# Altium project slave-18-ltc6813-1.PrjPcb (part 3 of 3)

## Sheet analog_in.SchDoc
size A3; SheetNumber: 7; SheetTotal: 15; SheetDescription: Analog Inputs
Used 2 times, as channels U_secondary_analog_in, U_primary_analog_in. Parts and nets are listed once, with the designators drawn on the sheet.
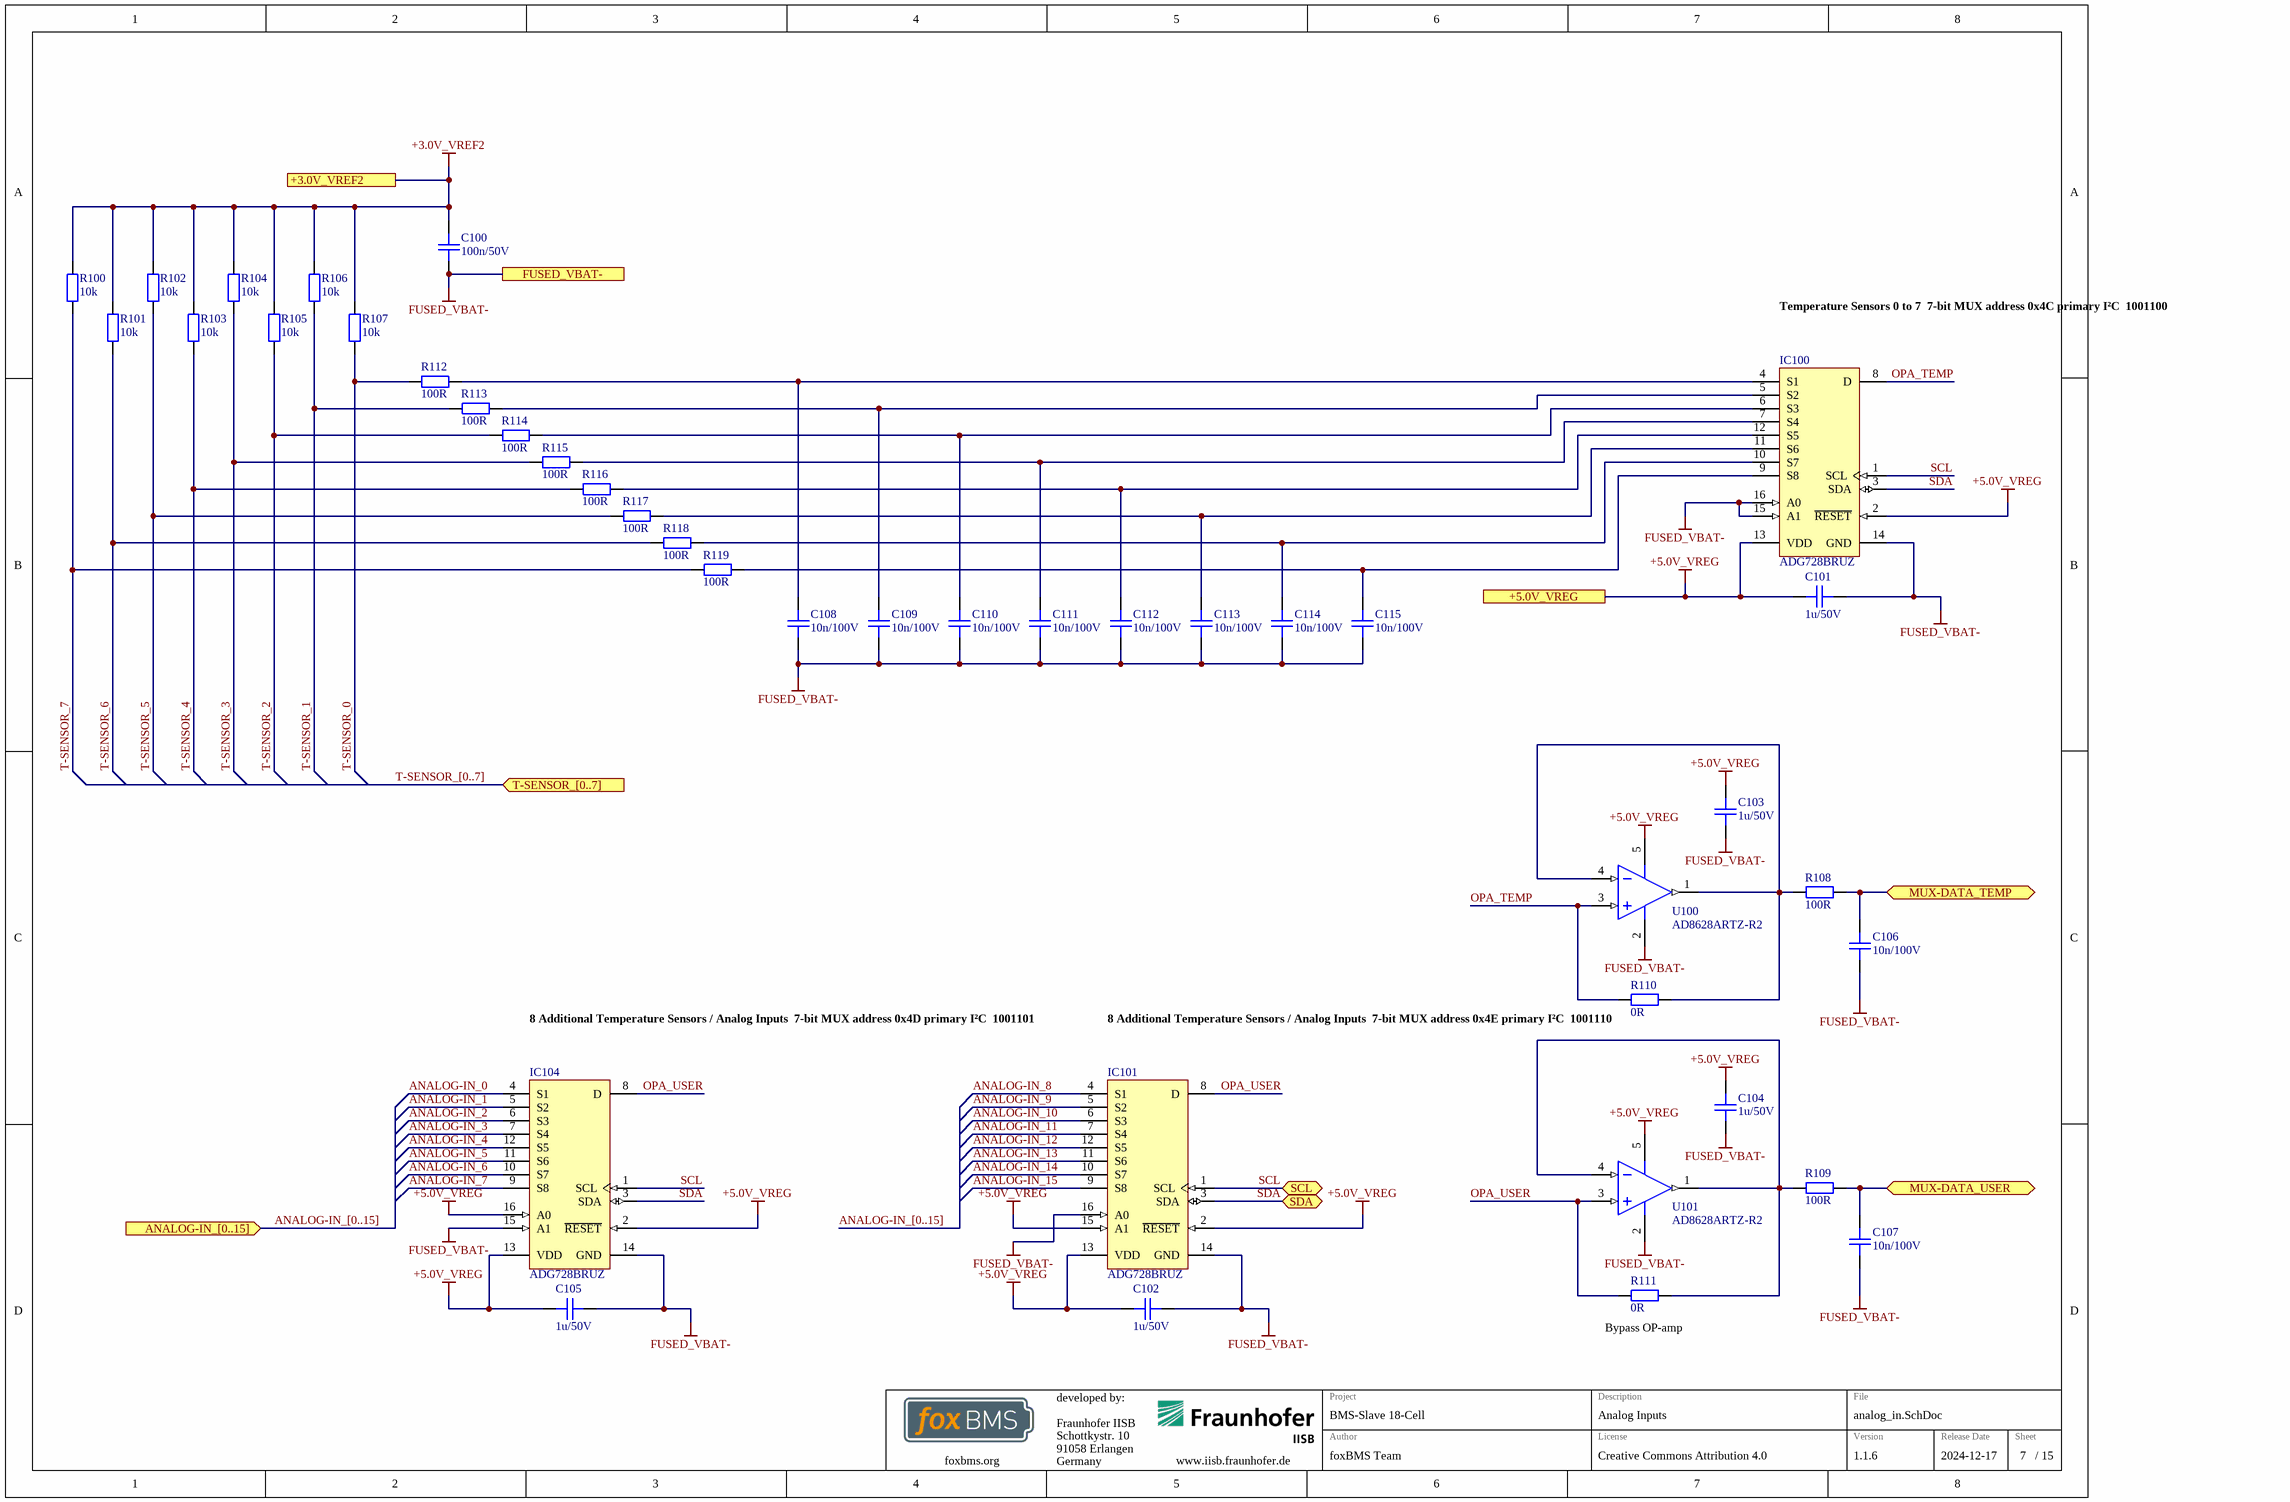
[diagram p10: analog_in.SchDoc]

### Parts
C100  100n/50V  [CAPC1608X08N]
C101  1u/50V  [CAPC2012X14N]
C102  1u/50V  [CAPC2012X14N]
C103  1u/50V  [CAPC2012X14N]
C104  1u/50V  [CAPC2012X14N]
C105  1u/50V  [CAPC2012X14N]
C106  10n/100V  [CAPC1608X08N]
C107  10n/100V  [CAPC1608X08N]
C108  10n/100V  [CAPC1608X08N]
C109  10n/100V  [CAPC1608X08N]
C110  10n/100V  [CAPC1608X08N]
C111  10n/100V  [CAPC1608X08N]
C112  10n/100V  [CAPC1608X08N]
C113  10n/100V  [CAPC1608X08N]
C114  10n/100V  [CAPC1608X08N]
C115  10n/100V  [CAPC1608X08N]
IC100  ADG728BRUZ  [ADI-RU-16_M]
IC101  ADG728BRUZ  [ADI-RU-16_M]
IC104  ADG728BRUZ  [ADI-RU-16_M]
R100  10k  [RESC1608X05N]
R101  10k  [RESC1608X05N]
R102  10k  [RESC1608X05N]
R103  10k  [RESC1608X05N]
R104  10k  [RESC1608X05N]
R105  10k  [RESC1608X05N]
R106  10k  [RESC1608X05N]
R107  10k  [RESC1608X05N]
R108  100R  [RESC1608X05N]
R109  100R  [RESC1608X05N]
R110  0R  [RESC1608X05N]
R111  0R  [RESC1608X05N]
R112  100R  [RESC1608X05N]
R113  100R  [RESC1608X05N]
R114  100R  [RESC1608X05N]
R115  100R  [RESC1608X05N]
R116  100R  [RESC1608X05N]
R117  100R  [RESC1608X05N]
R118  100R  [RESC1608X05N]
R119  100R  [RESC1608X05N]
U100  AD8628ARTZ-R2  [ADI-RJ-5_M]
U101  AD8628ARTZ-R2  [ADI-RJ-5_M]

### Ports
+3.0V_VREF2, +5.0V_VREG, ANALOG-IN_[0..15] (in), FUSED_VBAT-, MUX-DATA_TEMP (bidir), MUX-DATA_USER (bidir), SCL (bidir), SDA (bidir), T-SENSOR_[0..7] (in)

### Nets
+3.0V_VREF2: C100.2 R100.2 R101.2 R102.2 R103.2 R104.2 R105.2 R106.2 R107.2 ; port +3.0V_VREF2
+5.0V_VREG: C101.2 C102.2 C103.2 C104.2 C105.2 IC100.2(~{RESET}) IC100.13(VDD) IC101.2(~{RESET}) IC101.13(VDD) IC101.15(A1) IC104.2(~{RESET}) IC104.13(VDD) IC104.16(A0) U100.5(+V) U101.5(+V) ; port +5.0V_VREG
FUSED_VBAT-: C100.1 C101.1 C102.1 C103.1 C104.1 C105.1 C106.1 C107.1 C108.1 C109.1 C110.1 C111.1 C112.1 C113.1 C114.1 C115.1 IC100.14(GND) IC100.15(A1) IC100.16(A0) IC101.14(GND) IC101.16(A0) IC104.14(GND) IC104.15(A1) U100.2(-V) U101.2(-V) ; port FUSED_VBAT-
ANALOG-IN_0: IC104.4(S1)
ANALOG-IN_1: IC104.5(S2)
ANALOG-IN_2: IC104.6(S3)
ANALOG-IN_3: IC104.7(S4)
ANALOG-IN_4: IC104.12(S5)
ANALOG-IN_5: IC104.11(S6)
ANALOG-IN_6: IC104.10(S7)
ANALOG-IN_7: IC104.9(S8)
ANALOG-IN_8: IC101.4(S1)
ANALOG-IN_9: IC101.5(S2)
ANALOG-IN_10: IC101.6(S3)
ANALOG-IN_11: IC101.7(S4)
ANALOG-IN_12: IC101.12(S5)
ANALOG-IN_13: IC101.11(S6)
ANALOG-IN_14: IC101.10(S7)
ANALOG-IN_15: IC101.9(S8)
MUX-DATA_TEMP: C106.2 R108.2 ; port MUX-DATA_TEMP
MUX-DATA_USER: C107.2 R109.2 ; port MUX-DATA_USER
OPA_TEMP: IC100.8(D) R110.1 U100.3(+IN)
OPA_USER: IC101.8(D) IC104.8(D) R111.1 U101.3(+IN)
SCL: IC100.1(SCL) IC101.1(SCL) IC104.1(SCL) ; port SCL
SDA: IC100.3(SDA) IC101.3(SDA) IC104.3(SDA) ; port SDA
T-SENSOR_0: R107.1 R112.2
T-SENSOR_1: R106.1 R113.2
T-SENSOR_2: R105.1 R114.2
T-SENSOR_3: R104.1 R115.2
T-SENSOR_4: R103.1 R116.2
T-SENSOR_5: R102.1 R117.2
T-SENSOR_6: R101.1 R118.2
T-SENSOR_7: R100.1 R119.2
NetC108_2: C108.2 IC100.4(S1) R112.1
NetC109_2: C109.2 IC100.5(S2) R113.1
NetC110_2: C110.2 IC100.6(S3) R114.1
NetC111_2: C111.2 IC100.7(S4) R115.1
NetC112_2: C112.2 IC100.12(S5) R116.1
NetC113_2: C113.2 IC100.11(S6) R117.1
NetC114_2: C114.2 IC100.10(S7) R118.1
NetC115_2: C115.2 IC100.9(S8) R119.1
NetR108_1: R108.1 R110.2 U100.1(OUT) U100.4(-IN)
NetR109_1: R109.1 R111.2 U101.1(OUT) U101.4(-IN)

### Channels
U_secondary_analog_in: designators end in _2; ports +3.0V_VREF2=+3.0V_VREF2 +5.0V_VREG=+5.0V_VREG FUSED_VBAT-=FUSED_VBAT- MUX-DATA_TEMP=SECONDARY-MUX-DATA_TEMP MUX-DATA_USER=SECONDARY-MUX-DATA_USER SCL=SECONDARY-SCL SDA=SECONDARY-SDA
U_primary_analog_in: designators end in _1; ports +3.0V_VREF2=+3.0V_VREF2 +5.0V_VREG=+5.0V_VREG FUSED_VBAT-=FUSED_VBAT- MUX-DATA_TEMP=PRIMARY-MUX-DATA_TEMP MUX-DATA_USER=PRIMARY-MUX-DATA_USER SCL=PRIMARY-SCL SDA=PRIMARY-SDA

### Buses and harness runs
bus ANALOG-IN_[0..15]
bus ANALOG-IN_[0..15] = port ANALOG-IN_[0..15]
bus T-SENSOR_[0..7] = port T-SENSOR_[0..7]

### Notes on the sheet
- Temperature Sensors 0 to 7
  7-bit MUX address 0x4C primary I²C
  1001100
- 8 Additional Temperature Sensors / Analog Inputs
  7-bit MUX address 0x4D primary I²C
  1001101
- (near R110) 8 Additional Temperature Sensors / Analog Inputs
  7-bit MUX address 0x4E primary I²C
  1001110
- (near R111) Bypass OP-amp
- Fraunhofer IISB
- Schottkystr. 10
- developed by:
- 91058 Erlangen
- Germany
- Author
- Project
- License
- Description
- File
- Version
- Release Date
- Sheet
- foxbms.org <https://foxbms.org>
- www.iisb.fraunhofer.de <https://www.iisb.fraunhofer.de/>
- foxBMS Team
- /

### Library data of the parts
C100 = gen_C_ceramic_100n_50V_X7R_0603: MLCC; Capacitance: 100n; Rated Voltage: 50V; Dielectric: X7R; Case EIA: 0603; Case Metric: 1608; PnP Package: C_0603_10; PnP Value: 100n/50V/X7R; PnP equipped: x; Automotive Qualified: True; Part Number: gen_C_ceramic_100n_50V_X7R_0603; Supplier 1: Farnell; Supplier Part Number 1: 2525267; Supplier 2: Digikey; Supplier Part Number 2: 490-6049-1-ND; Supplier 3: Farnell; Supplier Part Number 3: 2070398
C101-C105 = gen_C_ceramic_1u_50V_X7R_0805: as C1401-C1403 on sheet LTC; Part Number: gen_C_ceramic_1u_50V_X7R_0805; Supplier 1: Farnell; Supplier Part Number 1: 2672199; Operating Temperature: -55°C - +125°C; Supplier 2: Farnell; Supplier Part Number 2: 2479894; Supplier 3: Farnell; Supplier Part Number 3: 2464630
C106-C115 = gen_C_ceramic_10n_100V_X7R_0603: MLCC; Capacitance: 10n; Rated Voltage: 100V; Dielectric: X7R; Case EIA: 0603; Case Metric: 1608; Automotive Qualified: True; Part Number: gen_C_ceramic_10n_100V_X7R_0603; Supplier 1: Farnell; Supplier Part Number 1: 1301715; Supplier 2: Farnell; Supplier Part Number 2: 2821192; Supplier 3: Farnell; Supplier Part Number 3: 2210878
IC100 IC101 IC104 = CMP-0798-00197-1: CMOS, Low Voltage, 2-Wire Serially Controlled, Matrix Switch, -40 to 85 degC, 16-pin SOP (RU-16), Tube; Manufacturer: Analog Devices; Ron (ohms): 2.5; Supply V Guar Performance: Single_(+3V), Single_(+5V); Max Analog Signal Range: 0 to Vdd; Bandwidth (Hz): 65M; ComponentLink3Description: Package Specification; Packing: Tube; PartNumber: ADG728BRUZ; ComponentLink1URL: http://www.analog.com/en/index.html; Mounting Technology: Surface Mount; DatasheetVersion: Rev. C; ComponentLink1Description: Manufacturer URL; ComponentLink3URL: http:/www.analog.com/static/imported-files/packages/36244347913743854010197452789RU16.pdf; ComponentLink2URL: http://www.analog.com/static/imported-files/data_sheets/ADG728_729.pdf; PackageVersion: Nov-02; PackageDescription: 16-Pin Thin Shrink Small Outline Package, Body 5 x 4.4 mm, Pitch 0.65 mm; Code_JEDEC: MO-153AB; PackageReference: RU-16; ComponentLink2Description: Datasheet
R100-R107 = gen_R_10k_0603: as R1421-R1427 on sheet LTC; Part Number: gen_R_10k_0603; Operating Temperature: -55°C - +155°C; Resistance: 10k; Series: E24, E96; PnP Value: 10k; Supplier 1: Farnell; Supplier Part Number 1: 2073349
R108 R109 R112-R119 = gen_R_100R_0603: SMD Resistor 100R 0603; Tolerance: 1%; Power: 0.1W; Case EIA: 0603; Case Metric: 1608; Maximum Working Voltage: 75V; PnP Package: R_0603; Automotive Qualified: True; Part Number: gen_R_100R_0603; Operating Temperature: -55°C - +155°C; Resistance: 100R; Series: E24, E96; PnP Value: 100R; Supplier 1: Digikey; Supplier Part Number 1: P100HCT-ND
R110 R111 = gen_R_0R_0603: as R1406-R1417 on sheet LTC; Part Number: gen_R_0R_0603; Operating Temperature: -55°C - +155°C; Resistance: 0R; Series: Jumper; PnP Value: 0R; Supplier 1: Farnell; Supplier Part Number 1: 2616580
U100 U101 = CMP-0384-01512-2: Single Channel RRIO Operational Amplifier, 2.5 MHz BW, 1 V/us SR, Industrial, 5-pin SOT23 (RJ-5), Reel; Manufacturer: Analog Devices; Generic Part Number: AD8628; Iq/Amp: 1.1mA; Automotive Qualified: Yes; V Span Max: 6V; Input Bias Current: 30pA; Slew Rate: 1V/us; Amplifiers Per Package: 1; Input Offset Voltage: 1uV; Small Signal Bandwidth: 2.5MHz; V Span Min: 2.7V; ComponentLink1Description: Manufacturer URL; DatasheetVersion: Rev. I; ComponentLink4Description: Reference Circuit; Code_JEDEC: MO-178-AA; PackageDescription: 5-Pin Small Outline Transistor Package, Body 2.9 x 1.6 mm, Pitch 0.95 mm; ComponentLink3URL: http://www.analog.com/static/imported-files/packages/PKG_PDF/SOT-23(RJ)/RJ_5.pdf; PackageReference: RJ-5; ComponentLink1URL: http://www.analog.com/en/index.html; PackageVersion: 121608-A; RevisionNote: Reference Circuit URL fixed; Mounting Technology: Surface Mount; ComponentLink2Description: Datasheet; ComponentLink3Description: Package Specification; ComponentLink4URL: http://www.analog.com/en/all-operational-amplifiers-op-amps/operational-amplifiers-op-amps/ad8628/products/product.html#product-recommendations; ComponentLink2URL: http://www.analog.com/static/imported-files/data_sheets/AD8628_8629_8630.pdf; PartNumber: AD8628ARTZ-R2

## Sheet daisy_chain_connectors.SchDoc
size A3; SheetNumber: 12; SheetTotal: 15; SheetDescription: Daisy-Chain Connectors
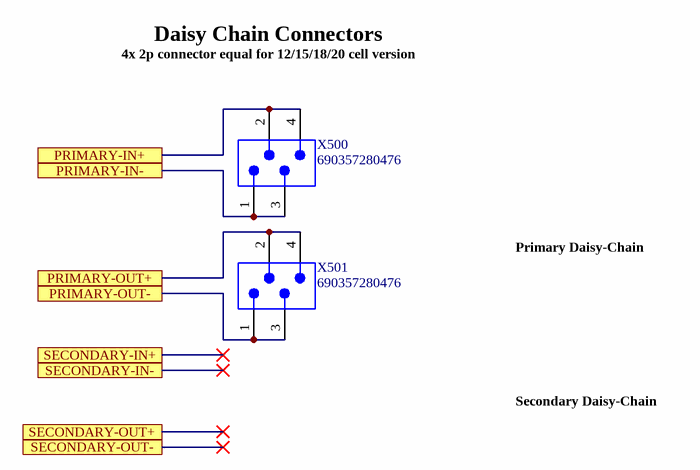
[diagram p11: daisy_chain_connectors.SchDoc]

### Parts
X500  690357280476  [690357280476]
X501  690357280476  [690357280476]

### Ports
PRIMARY-IN+, PRIMARY-IN-, PRIMARY-OUT+, PRIMARY-OUT-, SECONDARY-IN+, SECONDARY-IN-, SECONDARY-OUT+, SECONDARY-OUT-

### Nets
PRIMARY-IN+: X500.2 X500.4 ; port PRIMARY-IN+
PRIMARY-IN-: X500.1 X500.3 ; port PRIMARY-IN-
PRIMARY-OUT+: X501.2 X501.4 ; port PRIMARY-OUT+
PRIMARY-OUT-: X501.1 X501.3 ; port PRIMARY-OUT-

### Notes on the sheet
- Daisy Chain Connectors
- 4x 2p connector equal for 12/15/18/20 cell version
- Primary Daisy-Chain
- Secondary Daisy-Chain
- Fraunhofer IISB
- Schottkystr. 10
- developed by:
- 91058 Erlangen
- Germany
- Author
- Project
- License
- Description
- File
- Version
- Release Date
- Sheet
- foxbms.org <https://foxbms.org>
- www.iisb.fraunhofer.de <https://www.iisb.fraunhofer.de/>
- foxBMS Team
- /

### Library data of the parts
X500 X501 = CMP-1502-00889-2: NexarPartId: 8917647; Connector Type: Male Pin; Contact Resistance: 10mΩ; Pitch: 2.54mm; Insulation Resistance: 1GΩ; Number of Contacts: 4; Current Rating: 1.5A; Operating Supply Voltage: 100V; Gender: Male; Row Spacing: 1.4986mm; Orientation: Straight; Length: 5.91mm; RoHS: Compliant; Contact Plating: Tin; Contact Material: Bronze; Number of Positions: 4; Color: Red; Lead Pitch: 2.54mm; Number of Pins: 4; Packaging: Tape and Reel; Termination: Solder; Number of Rows: 2; REACH SVHC: Unknown; Max Operating Temperature: 105°C; Voltage Rating: 100V; Mount: Surface Mount; Fastening Type: Ramp; Min Operating Temperature: -40°C

## Sheet ext_supply_con.SchDoc
size A3; SheetNumber: 13; SheetTotal: 15; SheetDescription: External Supply Connectors
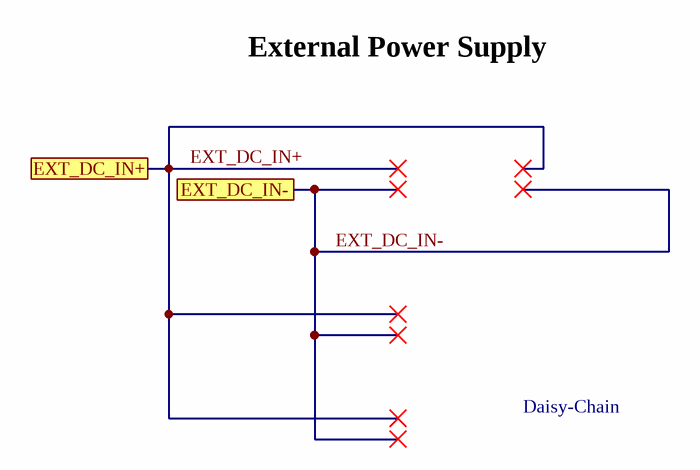
[diagram p12: ext_supply_con.SchDoc]

### Ports
EXT_DC_IN+, EXT_DC_IN-

### Notes on the sheet
- External Power Supply
- Daisy-Chain
- Fraunhofer IISB
- Schottkystr. 10
- developed by:
- 91058 Erlangen
- Germany
- Author
- Project
- License
- Description
- File
- Version
- Release Date
- Sheet
- foxbms.org <https://foxbms.org>
- www.iisb.fraunhofer.de <https://www.iisb.fraunhofer.de/>
- foxBMS Team
- /

## Sheet bat_connectors.SchDoc
size A3; SheetNumber: 14; SheetTotal: 15; SheetDescription: Sense Connectors
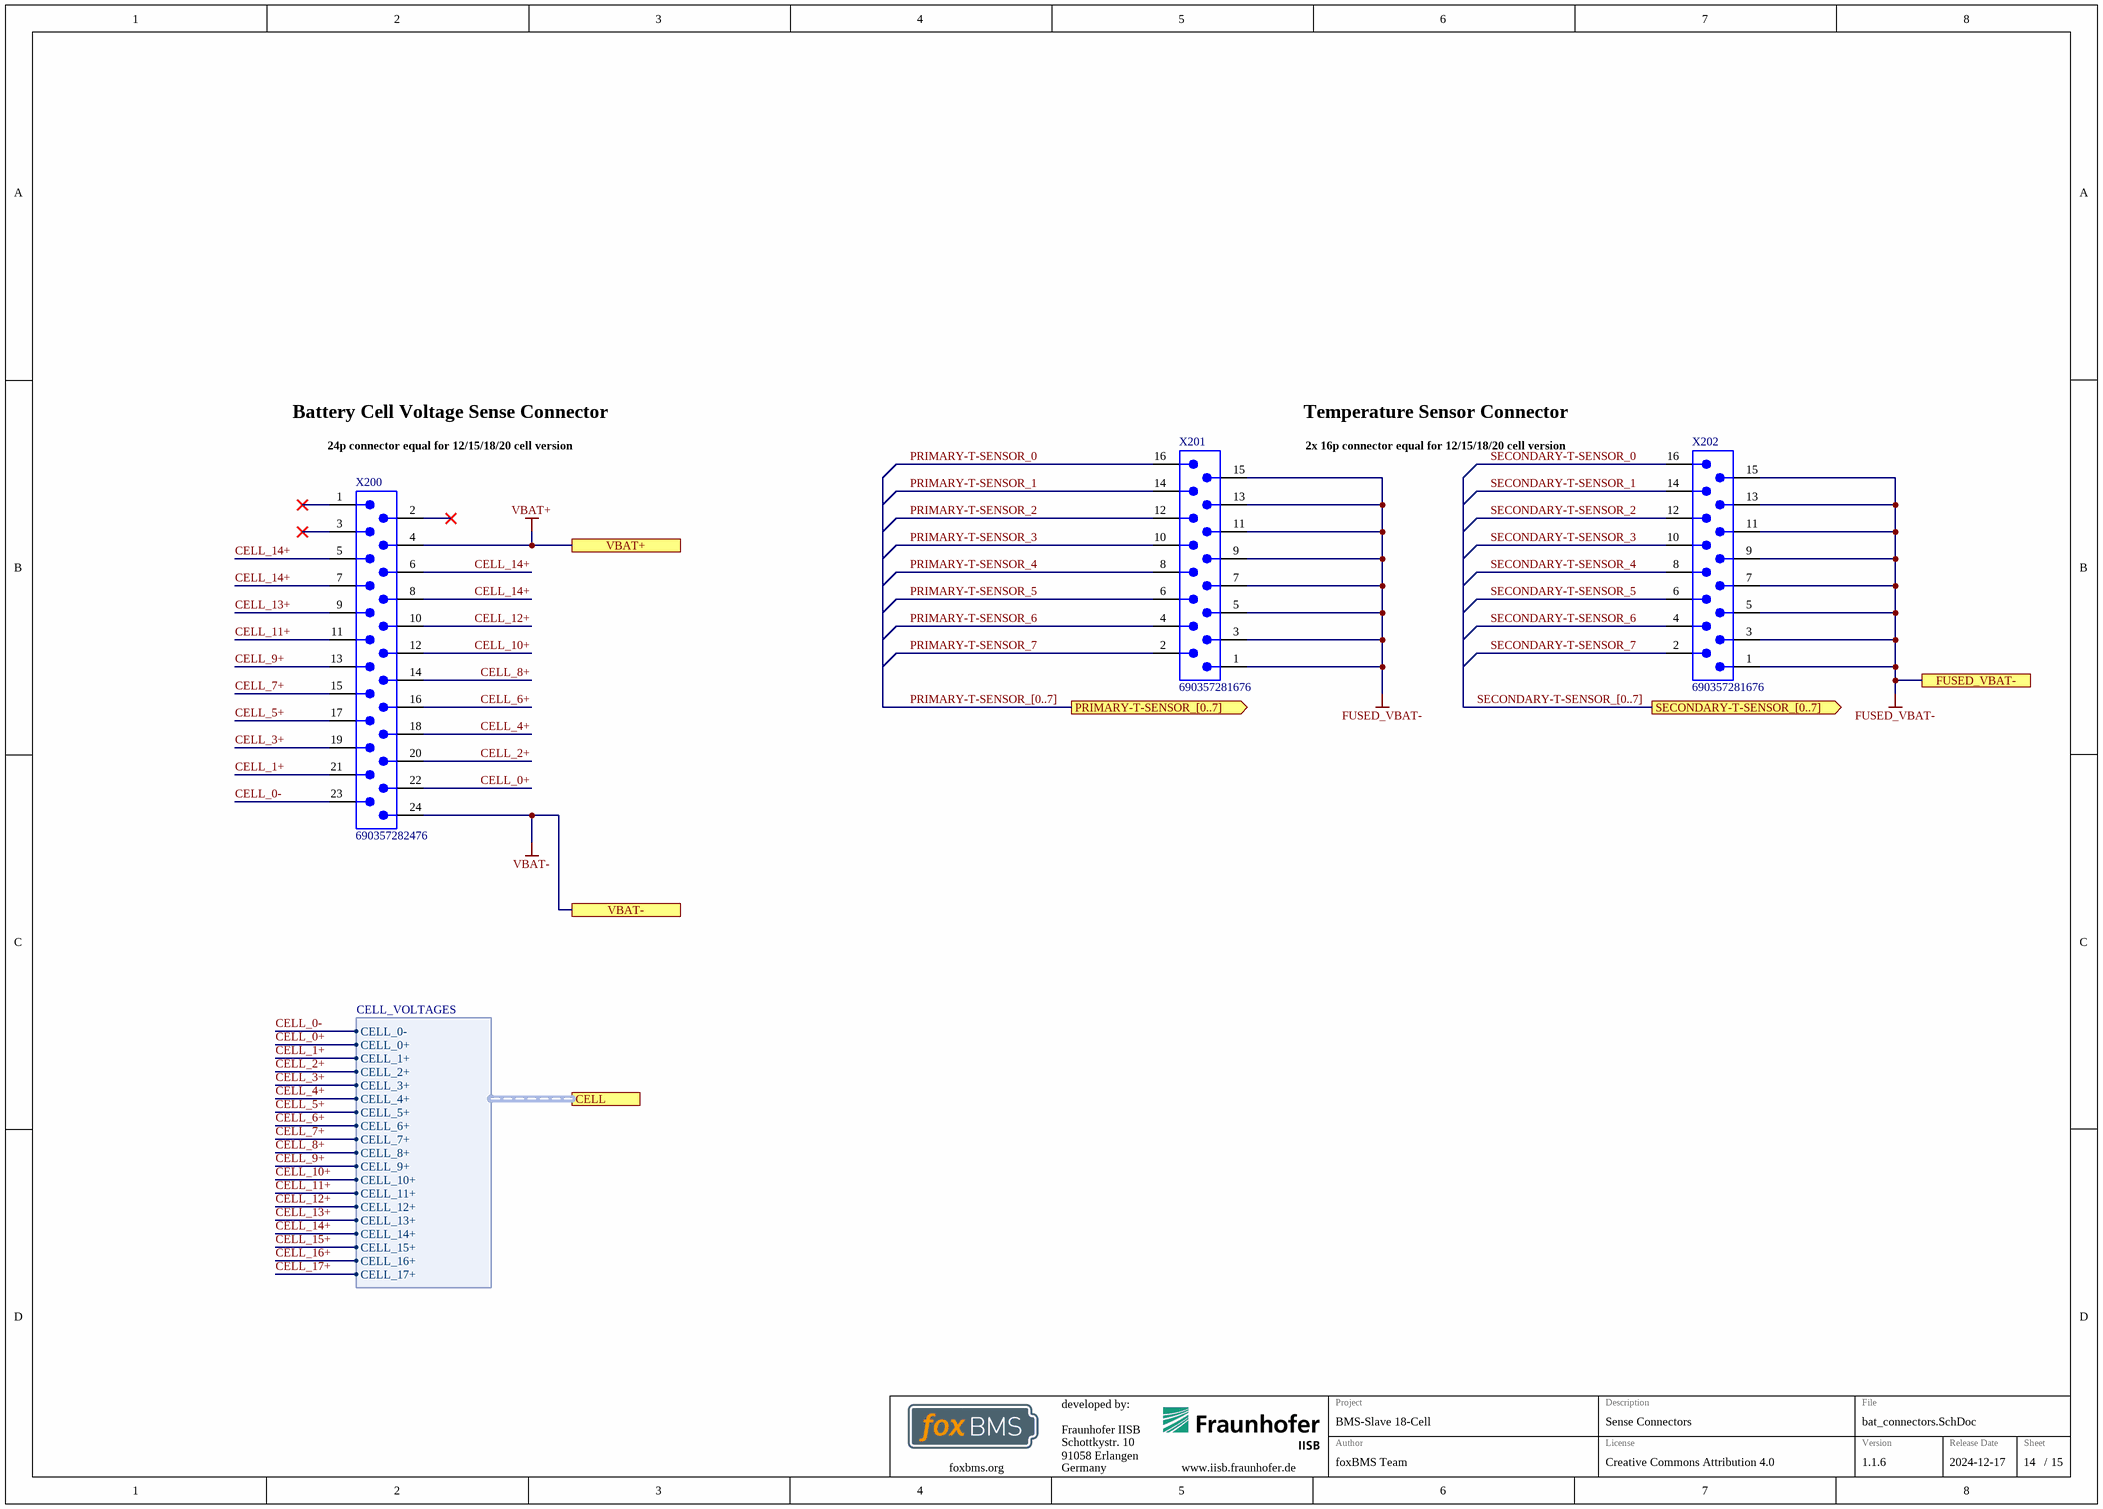
[diagram p13: bat_connectors.SchDoc]

### Parts
X200  690357282476  [690357282476]
X201  690357281676  [690357281676]
X202  690357281676  [690357281676]

### Ports
CELL (harness CELL_VOLTAGES), FUSED_VBAT-, PRIMARY-T-SENSOR_[0..7] (out), SECONDARY-T-SENSOR_[0..7] (out), VBAT+, VBAT-

### Harnesses
CELL_VOLTAGES: CELL_0-, CELL_0+, CELL_1+, CELL_2+, CELL_3+, CELL_4+, CELL_5+, CELL_6+, CELL_7+, CELL_8+, CELL_9+, CELL_10+, CELL_11+, CELL_12+, CELL_13+, CELL_14+, CELL_15+, CELL_16+, CELL_17+

### Nets
FUSED_VBAT-: X201.1 X201.3 X201.5 X201.7 X201.9 X201.11 X201.13 X201.15 X202.1 X202.3 X202.5 X202.7 X202.9 X202.11 X202.13 X202.15 ; port FUSED_VBAT-
VBAT+: X200.4 ; port VBAT+
VBAT-: X200.24 ; port VBAT-
CELL_0+: X200.22 ; port CELL.CELL_0+
CELL_0-: X200.23 ; port CELL.CELL_0-
CELL_1+: X200.21 ; port CELL.CELL_1+
CELL_2+: X200.20 ; port CELL.CELL_2+
CELL_3+: X200.19 ; port CELL.CELL_3+
CELL_4+: X200.18 ; port CELL.CELL_4+
CELL_5+: X200.17 ; port CELL.CELL_5+
CELL_6+: X200.16 ; port CELL.CELL_6+
CELL_7+: X200.15 ; port CELL.CELL_7+
CELL_8+: X200.14 ; port CELL.CELL_8+
CELL_9+: X200.13 ; port CELL.CELL_9+
CELL_10+: X200.12 ; port CELL.CELL_10+
CELL_11+: X200.11 ; port CELL.CELL_11+
CELL_12+: X200.10 ; port CELL.CELL_12+
CELL_13+: X200.9 ; port CELL.CELL_13+
CELL_14+: X200.5 X200.6 X200.7 X200.8 ; port CELL.CELL_14+
CELL_15+: port CELL.CELL_15+
CELL_16+: port CELL.CELL_16+
CELL_17+: port CELL.CELL_17+
PRIMARY-T-SENSOR_0: X201.16
PRIMARY-T-SENSOR_1: X201.14
PRIMARY-T-SENSOR_2: X201.12
PRIMARY-T-SENSOR_3: X201.10
PRIMARY-T-SENSOR_4: X201.8
PRIMARY-T-SENSOR_5: X201.6
PRIMARY-T-SENSOR_6: X201.4
PRIMARY-T-SENSOR_7: X201.2
SECONDARY-T-SENSOR_0: X202.16
SECONDARY-T-SENSOR_1: X202.14
SECONDARY-T-SENSOR_2: X202.12
SECONDARY-T-SENSOR_3: X202.10
SECONDARY-T-SENSOR_4: X202.8
SECONDARY-T-SENSOR_5: X202.6
SECONDARY-T-SENSOR_6: X202.4
SECONDARY-T-SENSOR_7: X202.2

Not connected (* = marked no-connect by the designer): X200 1* 2* 3*

### Buses and harness runs
bus PRIMARY-T-SENSOR_[0..7] = port PRIMARY-T-SENSOR_[0..7]
bus SECONDARY-T-SENSOR_[0..7] = port SECONDARY-T-SENSOR_[0..7]

### Notes on the sheet
- Battery Cell Voltage Sense Connector
- 24p connector equal for 12/15/18/20 cell version
- Temperature Sensor Connector
- 2x 16p connector equal for 12/15/18/20 cell version
- Fraunhofer IISB
- Schottkystr. 10
- developed by:
- 91058 Erlangen
- Germany
- Author
- Project
- License
- Description
- File
- Version
- Release Date
- Sheet
- foxbms.org <https://foxbms.org>
- www.iisb.fraunhofer.de <https://www.iisb.fraunhofer.de/>
- foxBMS Team
- /

### Library data of the parts
X200 = CMP-1502-00899-2: NexarPartId: 65759601; Gender: Male; Operating Supply Voltage: 100V; Current Rating: 1.5A; Insulation Resistance: 1GΩ; Contact Resistance: 10mΩ; Pitch: 2.54mm; Max Operating Temperature: 105°C; RoHS: Compliant; Lead Pitch: 2.54mm; Packaging: Tape and Reel; Number of Pins: 24; Length: 31.31mm; Min Operating Temperature: -40°C
X201 X202 = CMP-1502-00895-2: NexarPartId: 65759598; Operating Supply Voltage: 100V; Gender: Male; Pitch: 2.54mm; Insulation Resistance: 1GΩ; Contact Resistance: 10mΩ; Current Rating: 1.5A; RoHS: Compliant; Min Operating Temperature: -40°C; Packaging: Tape and Reel; Lead Pitch: 2.54mm; Number of Pins: 16; Max Operating Temperature: 105°C; Length: 21.15mm

## Sheet dcdc_converter.SchDoc
size A3; SheetNumber: 15; SheetTotal: 15; SheetDescription: DC/DC
Used 2 times, as channels U_primary_dcdc_converter, U_secondary_dcdc_converter. Parts and nets are listed once, with the designators drawn on the sheet.
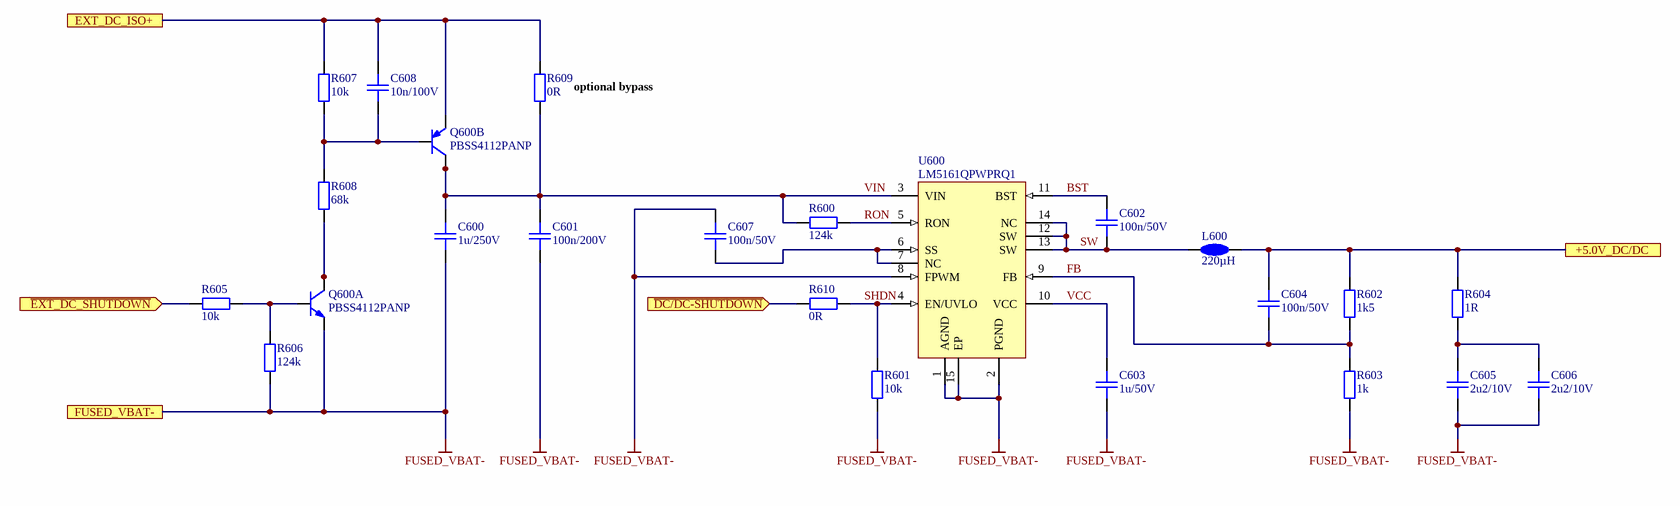
[diagram p14: dcdc_converter.SchDoc]

### Parts
C600  1u/250V  [CAPC4532X16N]
C601  100n/200V  [CAPC3216X18N]
C602  100n/50V  [CAPC1608X08N]
C603  1u/50V  [CAPC2012X14N]
C604  100n/50V  [CAPC1608X08N]
C605  2u2/10V  [CAPC2012X14N]
C606  2u2/10V  [CAPC2012X14N]
C607  100n/50V  [CAPC1608X08N]
C608  10n/100V  [CAPC1608X08N]
L600  220µH  [TYS6045221M-10]
Q600  PBSS4112PANP  [PBSS4112PANP]  (parts A,B of 2)
R600  124k  [RESC1608X05N]
R601  10k  [RESC1608X05N]
R602  1k5  [RESC1608X05N]
R603  1k  [RESC1608X05N]
R604  1R  [RESC2012X05N]
R605  10k  [RESC1608X05N]
R606  124k  [RESC1608X05N]
R607  10k  [RESC1608X05N]
R608  68k  [RESC1608X05N]
R609  0R  [RESC1608X05N]
R610  0R  [RESC1608X05N]
U600  LM5161QPWPRQ1  [PWP0014A]

### Ports
+5.0V_DC/DC, EXT_DC_ISO+, FUSED_VBAT-, ~{DC/DC-SHUTDOWN} (in), ~{EXT_DC_SHUTDOWN} (in)

### Nets
FUSED_VBAT-: C600.1 C601.1 C603.1 C605.1 C606.1 C607.2 Q600.1(E) R601.2 R603.2 R606.1 U600.1(AGND) U600.2(PGND) U600.8(FPWM) U600.15(EP) ; port FUSED_VBAT-
+5.0V_DC/DC: C604.2 L600.2 R602.1 R604.1 ; port +5.0V_DC/DC
~{DC/DC-SHUTDOWN}: R610.2 ; port ~{DC/DC-SHUTDOWN}
~{EXT_DC_SHUTDOWN}: R605.1 ; port ~{EXT_DC_SHUTDOWN}
BST: C602.2 U600.11(BST)
EXT_DC_ISO+: C608.1 Q600.4(E) R607.2 R609.2 ; port EXT_DC_ISO+
FB: C604.1 R602.2 R603.1 U600.9(FB)
RON: R600.1 U600.5(RON)
SHDN: R601.1 R610.1 U600.4(EN/UVLO)
SW: C602.1 L600.1 U600.12(SW) U600.13(SW) U600.14(NC)
VCC: C603.2 U600.10(VCC)
VIN: C600.2 C601.2 Q600.3(C) Q600.8(C) R600.2 R609.1 U600.3(VIN)
NetC605_2: C605.2 C606.2 R604.2
NetC607_1: C607.1 U600.6(SS) U600.7(NC)
NetC608_2: C608.2 Q600.5(B) R607.1 R608.2
NetQ600_2: Q600.2(B) R605.2 R606.2
NetQ600_6: Q600.6(C) Q600.7(C) R608.1

### Channels
U_primary_dcdc_converter: designators end in _1; ports +5.0V_DC/DC=+5.0V_VREG EXT_DC_ISO+=EXT_DC_ISO+ FUSED_VBAT-=FUSED_VBAT- ~{DC/DC-SHUTDOWN}=PRIMARY-LTC-DRIVE ~{EXT_DC_SHUTDOWN}=PRIMARY-LTC-DRIVE
U_secondary_dcdc_converter: designators end in _2; ports +5.0V_DC/DC=+5.0V_VREG EXT_DC_ISO+=EXT_DC_ISO+ FUSED_VBAT-=FUSED_VBAT- ~{DC/DC-SHUTDOWN}=SECONDARY-LTC-DRIVE ~{EXT_DC_SHUTDOWN}=SECONDARY-LTC-DRIVE

### Notes on the sheet
- (near R609) optional bypass
- Fraunhofer IISB
- Schottkystr. 10
- developed by:
- 91058 Erlangen
- Germany
- Author
- Project
- License
- Description
- File
- Version
- Release Date
- Sheet
- foxbms.org <https://foxbms.org>
- www.iisb.fraunhofer.de <https://www.iisb.fraunhofer.de/>
- foxBMS Team
- /

### Library data of the parts
C600 = gen_C_ceramic_1u_250V_X7R_1812: MLCC; Capacitance: 1u; Rated Voltage: 250V; Dielectric: X7T; Case EIA: 1812; Case Metric: 4532; Automotive Qualified: True; Part Number: gen_C_ceramic_1u_250V_X7R_1812; Supplier 1: Farnell; Supplier Part Number 1: 2435499
C601 = gen_C_ceramic_100n_200V_X7R_1206: MLCC; Capacitance: 100n; Rated Voltage: 200V; Dielectric: X7R; Case EIA: 1206; Case Metric: 3216; Automotive Qualified: True; Part Number: gen_C_ceramic_100n_200V_X7R_1206; Supplier 1: Farnell; Supplier Part Number 1: 2673161; Supplier 2: Farnell; Supplier Part Number 2: 2520773
C602 C604 C607 = gen_C_ceramic_100n_50V_X7R_0603: as C100 on sheet analog_in; Part Number: gen_C_ceramic_100n_50V_X7R_0603; Supplier 1: Farnell; Supplier Part Number 1: 2525267; Supplier 2: Digikey; Supplier Part Number 2: 490-6049-1-ND; Supplier 3: Farnell; Supplier Part Number 3: 2070398
C603 = gen_C_ceramic_1u_50V_X7R_0805: as C1401-C1403 on sheet LTC; Part Number: gen_C_ceramic_1u_50V_X7R_0805; Supplier 1: Farnell; Supplier Part Number 1: 2672199; Operating Temperature: -55°C - +125°C; Supplier 2: Farnell; Supplier Part Number 2: 2479894; Supplier 3: Farnell; Supplier Part Number 3: 2464630
C605 C606 = gen_C_ceramic_2u2_10V_X7R_0805: MLCC; Capacitance: 2u2; Rated Voltage: 10V; Dielectric: X7R; Case EIA: 0805; Case Metric: 2012; Automotive Qualified: True; Part Number: gen_C_ceramic_2u2_10V_X7R_0805; Supplier 1: Farnell; Supplier Part Number 1: 2478259; Supplier 2: Farnell; Supplier Part Number 2: 2070513
C608 = gen_C_ceramic_10n_100V_X7R_0603: as C106-C115 on sheet analog_in; Part Number: gen_C_ceramic_10n_100V_X7R_0603; Supplier 1: Farnell; Supplier Part Number 1: 1301715; Supplier 2: Farnell; Supplier Part Number 2: 2821192; Supplier 3: Farnell; Supplier Part Number 3: 2210878
L600 = TYS6045221M-10: Power Inductor; Manufacturer: Laird-Signal Integrity Products; Rated Current: 590mA; Saturation Current: 700mA; Automotive Qualified: True; Part Number: TYS6045221M-10; Operating Temperature: -55°C - +150°C; ComponentLink1Description: Datasheet; ComponentLink1URL: http://assets.lairdtech.com/home/brandworld/files/TYS6045221M-10.pdf; Inductance: 220µH; Supplier 1: Digikey; Supplier Part Number 1: 240-2742-1-ND
Q600 = PBSS4112PANP: Dual NPN/PNP Transistor; Part Name: DUAL PNP/NPN; Manufacturer: Nexperia; Maximum Drain-Source Voltage: 120V; Maximum Continous Drain Current (25°C): 1A; Automotive Qualified: True; Part Number: PBSS4112PANP; Operating Temperature: -55°C - +150°C; ComponentLink1Description: Datasheet; ComponentLink1URL: https://assets.nexperia.com/documents/data-sheet/PBSS4112PANP.pdf; Supplier 2: Digikey; Supplier Part Number 2: 1727-1068-1-ND; Supplier 3: Mouser; Supplier Part Number 3: 771-PBSS4112PANP
R600 R606 = gen_R_124k_0603: SMD Resistor 124k 0603; Tolerance: 1%; Power: 0.1W; Case EIA: 0603; Case Metric: 1608; Maximum Working Voltage: 75V; PnP Package: R_0603; Automotive Qualified: True; Part Number: gen_R_124k_0603; Operating Temperature: -55°C - +155°C; Resistance: 124k; Series: E96; PnP Value: 124k; Supplier 1: Farnell; Supplier Part Number 1: 2138508
R601 R605 R607 = gen_R_10k_0603: as R1421-R1427 on sheet LTC; Part Number: gen_R_10k_0603; Operating Temperature: -55°C - +155°C; Resistance: 10k; Series: E24, E96; PnP Value: 10k; Supplier 1: Farnell; Supplier Part Number 1: 2073349
R602 = gen_R_1k5_0603: SMD Resistor 1k5 0603; Tolerance: 1%; Power: 0.1W; Case EIA: 0603; Case Metric: 1608; Maximum Working Voltage: 75V; PnP Package: R_0603; Automotive Qualified: True; Part Number: gen_R_1k5_0603; Operating Temperature: -55°C - +155°C; Resistance: 1k5; Series: E24, E96; PnP Value: 1k5; Supplier 1: Farnell; Supplier Part Number 1: 2616745
R603 = gen_R_1k_0603: SMD Resistor 1k 0603; Tolerance: 1%; Power: 0.1W; Case EIA: 0603; Case Metric: 1608; Maximum Working Voltage: 75V; PnP Package: R_0603; Automotive Qualified: True; PnP equipped: x; Part Number: gen_R_1k_0603; Operating Temperature: -55°C - +155°C; Resistance: 1k; Series: E24, E96; PnP Value: 1k; Supplier 1: Farnell; Supplier Part Number 1: 1652848
R604 = gen_R_1R_0805: SMD Resistor 1R 0805; Tolerance: 1%; Power: 0.125W; Case EIA: 0805; Case Metric: 2012; Maximum Working Voltage: 150V; PnP Package: R_0805; Automotive Qualified: True; Part Number: gen_R_1R_0805; Operating Temperature: -55°C - +155°C; Resistance: 1R; Series: E24, E96; PnP Value: 1R; Supplier 1: Farnell; Supplier Part Number 1: 2616757
R608 = gen_R_68k_0603: SMD Resistor 68k 0603; Tolerance: 1%; Power: 0.1W; Case EIA: 0603; Case Metric: 1608; Maximum Working Voltage: 75V; PnP Package: R_0603; Automotive Qualified: False; Part Number: gen_R_68k_0603; Operating Temperature: -55°C - +155°C; Resistance: 68k; Series: E24; PnP Value: 68k
R609 R610 = gen_R_0R_0603: as R1406-R1417 on sheet LTC; Part Number: gen_R_0R_0603; Operating Temperature: -55°C - +155°C; Resistance: 0R; Series: Jumper; PnP Value: 0R; Supplier 1: Farnell; Supplier Part Number 1: 2616580
U600 = LM5161QPWPRQ1: Automotive DC/DC buck converter; Manufacturer: Texas Instruments; PnP Package: HTSSOP-14; Automotive Qualified: True; Part Number: LM5161QPWPRQ1; Part Name: LM5161QPWPRQ1; Operating Temperature: −40°C - +125°C; Supplier 1: Digikey; Supplier Part Number 1: 296-47791-1-ND; Supplier 2: Mouser; Supplier Part Number 2: 595-LM5161QPWPRQ1

## Nets that join several sheets
+3.0V_VREF2: connectors (C401.2 C405.2 X400.17), U_primary_LTC (C1402_1.2 IC1400_1.50 TP1402_1.1), U_primary_analog_in (9 pins)
+3.0V_VREF2: connectors (C400.2 C406.2 X401.17), U_secondary_analog_in (9 pins), U_secondary_LTC (C1402_2.2 IC1400_2.50 TP1402_2.1)
+5.0V_VREG: connectors (C402.2 C404.2), feedback (D1100.2), U_primary_LTC (16 pins), U_primary_dcdc_converter (C604_1.2 L600_1.2 R602_1.1 R604_1.1), U_primary_digital_io (13 pins), U_primary_eeprom_temp_sens (6 pins), U_primary_analog_in (15 pins)
+5.0V_VREG: connectors (C403.2 C407.2), feedback (D1100.1), U_secondary_digital_io (13 pins), U_secondary_eeprom_temp_sens (6 pins), U_secondary_analog_in (15 pins), U_secondary_dcdc_converter (C604_2.2 L600_2.2 R602_2.1 R604_2.1), U_secondary_LTC (16 pins)
FUSED_VBAT+: cell_fuses (F300.2), U_primary_LTC (D1400_1.1), U_secondary_LTC (D1400_2.1)
FUSED_VBAT-: cell_fuses (F320.2), U_primary_input_filter (18 pins), U_secondary_input_filter (18 pins), ext_supply (5 pins), connectors (10 pins), feedback (C1100.1 R1118.2), U_primary_LTC (14 pins), U_secondary_digital_io (C700_2.1 C701_2.1 U700_2.2 U700_2.8), U_secondary_eeprom_temp_sens (5 pins), U_secondary_analog_in (25 pins), bat_connectors (16 pins), U_primary_dcdc_converter (14 pins), U_secondary_dcdc_converter (14 pins), U_secondary_LTC (14 pins), U_primary_digital_io (C700_1.1 C701_1.1 U700_1.2 U700_1.8), U_primary_eeprom_temp_sens (5 pins), U_primary_analog_in (25 pins)
VBAT+: cell_fuses (F300.1 SJ300.1), bat_connectors (X200.4)
VBAT-: cell_fuses (F320.1 SJ301.2), bat_connectors (X200.24)
CELL_0+: cell_fuses (F318.1), bat_connectors (X200.22)
CELL_0-: cell_fuses (F319.1 SJ301.1), bat_connectors (X200.23)
CELL_1+: cell_fuses (F317.1), bat_connectors (X200.21)
CELL_2+: cell_fuses (F316.1), bat_connectors (X200.20)
CELL_3+: cell_fuses (F315.1), bat_connectors (X200.19)
CELL_4+: cell_fuses (F314.1), bat_connectors (X200.18)
CELL_5+: cell_fuses (F313.1), bat_connectors (X200.17)
CELL_6+: cell_fuses (F312.1), bat_connectors (X200.16)
CELL_7+: cell_fuses (F311.1), bat_connectors (X200.15)
CELL_8+: cell_fuses (F310.1), bat_connectors (X200.14)
CELL_9+: cell_fuses (F309.1), bat_connectors (X200.13)
CELL_10+: cell_fuses (F308.1), bat_connectors (X200.12)
CELL_11+: cell_fuses (F307.1), bat_connectors (X200.11)
CELL_12+: cell_fuses (F306.1), bat_connectors (X200.10)
CELL_13+: cell_fuses (F305.1), bat_connectors (X200.9)
CELL_14+: cell_fuses (F304.1 SJ300.2), bat_connectors (X200.5 X200.6 X200.7 X200.8)
CELL_FEEDBACK.CELL0_FEEDBACK+: feedback (R1105.1), passive_balancing (R1505.2 R1511.2 T1505.3)
CELL_FEEDBACK.CELL1_FEEDBACK+: feedback (R1104.1), passive_balancing (R1504.2 R1510.2 T1504.3)
CELL_FEEDBACK.CELL2_FEEDBACK+: feedback (R1103.1), passive_balancing (R1503.2 R1509.2 T1503.3)
CELL_FEEDBACK.CELL3_FEEDBACK+: feedback (R1102.1), passive_balancing (R1502.2 R1508.2 T1502.3)
CELL_FEEDBACK.CELL4_FEEDBACK+: feedback (R1101.1), passive_balancing (R1501.2 R1507.2 T1501.3)
CELL_FEEDBACK.CELL5_FEEDBACK+: feedback (R1100.1), passive_balancing (R1500.2 R1506.2 T1500.3)
CELL_FEEDBACK.CELL6_FEEDBACK+: feedback (R1111.1), passive_balancing (R1523.2 R1529.2 T1511.3)
CELL_FEEDBACK.CELL7_FEEDBACK+: feedback (R1110.1), passive_balancing (R1522.2 R1528.2 T1510.3)
CELL_FEEDBACK.CELL8_FEEDBACK+: feedback (R1109.1), passive_balancing (R1521.2 R1527.2 T1509.3)
CELL_FEEDBACK.CELL9_FEEDBACK+: feedback (R1108.1), passive_balancing (R1520.2 R1526.2 T1508.3)
CELL_FEEDBACK.CELL10_FEEDBACK+: feedback (R1107.1), passive_balancing (R1519.2 R1525.2 T1507.3)
CELL_FEEDBACK.CELL11_FEEDBACK+: feedback (R1106.1), passive_balancing (R1518.2 R1524.2 T1506.3)
CELL_FEEDBACK.CELL12_FEEDBACK+: feedback (R1117.1), passive_balancing (R1541.2 R1547.2 T1517.3)
CELL_FEEDBACK.CELL13_FEEDBACK+: feedback (R1116.1), passive_balancing (R1540.2 R1546.2 T1516.3)
CELL_FEEDBACK.CELL14_FEEDBACK+: feedback (R1115.1), passive_balancing (R1539.2 R1545.2 T1515.3)
CELL_FEEDBACK.CELL15_FEEDBACK+: feedback (R1114.1), passive_balancing (R1538.2 R1544.2 T1514.3)
CELL_FEEDBACK.CELL16_FEEDBACK+: feedback (R1113.1), passive_balancing (R1537.2 R1543.2 T1513.3)
CELL_FEEDBACK.CELL17_FEEDBACK+: feedback (R1112.1), passive_balancing (R1536.2 R1542.2 T1512.3)
EXT_DC_ISO+: ext_supply (C907.2 C908.2 D901.1 TP902.1), U_primary_LTC (D1400_1.2 D1401_1.1 R1401_1.1), U_primary_dcdc_converter (C608_1.1 Q600_1.4 R607_1.2 R609_1.2), U_secondary_dcdc_converter (C608_2.1 Q600_2.4 R607_2.2 R609_2.2), U_secondary_LTC (D1400_2.2 D1401_2.1 R1401_2.1)
FUSED_CELL.CELL_0+: cell_fuses (F318.2), U_primary_input_filter (R1305_1.1), U_secondary_input_filter (R1305_2.1), feedback (U1104.2), passive_balancing (R1504.1 R1510.1 T1505.2)
FUSED_CELL.CELL_0-: cell_fuses (F319.2), U_primary_input_filter (R1306_1.1), U_secondary_input_filter (R1306_2.1), feedback (U1105.2), passive_balancing (R1505.1 R1511.1)
FUSED_CELL.CELL_1+: cell_fuses (F317.2), U_primary_input_filter (R1304_1.1), U_secondary_input_filter (R1304_2.1), feedback (U1103.2), passive_balancing (R1503.1 R1509.1 T1504.2)
FUSED_CELL.CELL_2+: cell_fuses (F316.2), U_primary_input_filter (R1303_1.1), U_secondary_input_filter (R1303_2.1), feedback (U1102.2), passive_balancing (R1502.1 R1508.1 T1503.2)
FUSED_CELL.CELL_3+: cell_fuses (F315.2), U_primary_input_filter (R1302_1.1), U_secondary_input_filter (R1302_2.1), feedback (U1101.2), passive_balancing (R1501.1 R1507.1 T1502.2)
FUSED_CELL.CELL_4+: cell_fuses (F314.2), U_primary_input_filter (R1301_1.1), U_secondary_input_filter (R1301_2.1), feedback (U1100.2), passive_balancing (R1500.1 R1506.1 T1501.2)
FUSED_CELL.CELL_5+: cell_fuses (F313.2), U_primary_input_filter (R1300_1.1), U_secondary_input_filter (R1300_2.1), feedback (U1111.2), passive_balancing (R1523.1 R1529.1 T1500.2)
FUSED_CELL.CELL_6+: cell_fuses (F312.2), U_primary_input_filter (R1312_1.1), U_secondary_input_filter (R1312_2.1), feedback (U1110.2), passive_balancing (R1522.1 R1528.1 T1511.2)
FUSED_CELL.CELL_7+: cell_fuses (F311.2), U_primary_input_filter (R1311_1.1), U_secondary_input_filter (R1311_2.1), feedback (U1109.2), passive_balancing (R1521.1 R1527.1 T1510.2)
FUSED_CELL.CELL_8+: cell_fuses (F310.2), U_primary_input_filter (R1310_1.1), U_secondary_input_filter (R1310_2.1), feedback (U1108.2), passive_balancing (R1520.1 R1526.1 T1509.2)
FUSED_CELL.CELL_9+: cell_fuses (F309.2), U_primary_input_filter (R1309_1.1), U_secondary_input_filter (R1309_2.1), feedback (U1107.2), passive_balancing (R1519.1 R1525.1 T1508.2)
FUSED_CELL.CELL_10+: cell_fuses (F308.2), U_primary_input_filter (R1308_1.1), U_secondary_input_filter (R1308_2.1), feedback (U1106.2), passive_balancing (R1518.1 R1524.1 T1507.2)
FUSED_CELL.CELL_11+: cell_fuses (F307.2), U_primary_input_filter (R1307_1.1), U_secondary_input_filter (R1307_2.1), feedback (U1117.2), passive_balancing (R1541.1 R1547.1 T1506.2)
FUSED_CELL.CELL_12+: cell_fuses (F306.2), U_primary_input_filter (R1318_1.1), U_secondary_input_filter (R1318_2.1), feedback (U1116.2), passive_balancing (R1540.1 R1546.1 T1517.2)
FUSED_CELL.CELL_13+: cell_fuses (F305.2), U_primary_input_filter (R1317_1.1), U_secondary_input_filter (R1317_2.1), feedback (U1115.2), passive_balancing (R1539.1 R1545.1 T1516.2)
FUSED_CELL.CELL_14+: cell_fuses (F304.2), U_primary_input_filter (R1313_1.1 R1314_1.1 R1315_1.1 R1316_1.1), U_secondary_input_filter (R1313_2.1 R1314_2.1 R1315_2.1 R1316_2.1), feedback (U1112.2 U1113.2 U1114.2), passive_balancing (10 pins)
GLOBAL-BAL-FB: feedback (20 pins), U_primary_LTC (R1413_1.1), U_secondary_LTC (R1413_2.1)
PRIMARY-ANALOG-IN_0: connectors (X400.1), U_primary_analog_in (IC104_1.4)
PRIMARY-ANALOG-IN_1: connectors (X400.2), U_primary_analog_in (IC104_1.5)
PRIMARY-ANALOG-IN_2: connectors (X400.3), U_primary_analog_in (IC104_1.6)
PRIMARY-ANALOG-IN_3: connectors (X400.4), U_primary_analog_in (IC104_1.7)
PRIMARY-ANALOG-IN_4: connectors (X400.5), U_primary_analog_in (IC104_1.12)
PRIMARY-ANALOG-IN_5: connectors (X400.6), U_primary_analog_in (IC104_1.11)
PRIMARY-ANALOG-IN_6: connectors (X400.7), U_primary_analog_in (IC104_1.10)
PRIMARY-ANALOG-IN_7: connectors (X400.8), U_primary_analog_in (IC104_1.9)
PRIMARY-ANALOG-IN_8: connectors (X400.9), U_primary_analog_in (IC101_1.4)
PRIMARY-ANALOG-IN_9: connectors (X400.10), U_primary_analog_in (IC101_1.5)
PRIMARY-ANALOG-IN_10: connectors (X400.11), U_primary_analog_in (IC101_1.6)
PRIMARY-ANALOG-IN_11: connectors (X400.12), U_primary_analog_in (IC101_1.7)
PRIMARY-ANALOG-IN_12: connectors (X400.13), U_primary_analog_in (IC101_1.12)
PRIMARY-ANALOG-IN_13: connectors (X400.14), U_primary_analog_in (IC101_1.11)
PRIMARY-ANALOG-IN_14: connectors (X400.15), U_primary_analog_in (IC101_1.10)
PRIMARY-ANALOG-IN_15: connectors (X400.16), U_primary_analog_in (IC101_1.9)
PRIMARY-C0: U_primary_input_filter (C1311_1.2 R1306_1.2 Z1305_1.2), U_primary_LTC (IC1400_1.38)
PRIMARY-C1: U_primary_input_filter (6 pins), U_primary_LTC (IC1400_1.36)
PRIMARY-C2: U_primary_input_filter (6 pins), U_primary_LTC (IC1400_1.34)
PRIMARY-C3: U_primary_input_filter (6 pins), U_primary_LTC (IC1400_1.32)
PRIMARY-C4: U_primary_input_filter (6 pins), U_primary_LTC (IC1400_1.30)
PRIMARY-C5: U_primary_input_filter (6 pins), U_primary_LTC (IC1400_1.28)
PRIMARY-C6: U_primary_input_filter (6 pins), U_primary_LTC (IC1400_1.26)
PRIMARY-C7: U_primary_input_filter (6 pins), U_primary_LTC (IC1400_1.24)
PRIMARY-C8: U_primary_input_filter (6 pins), U_primary_LTC (IC1400_1.22)
PRIMARY-C9: U_primary_input_filter (6 pins), U_primary_LTC (IC1400_1.20)
PRIMARY-C10: U_primary_input_filter (6 pins), U_primary_LTC (IC1400_1.18)
PRIMARY-C11: U_primary_input_filter (6 pins), U_primary_LTC (IC1400_1.16)
PRIMARY-C12: U_primary_input_filter (6 pins), U_primary_LTC (IC1400_1.14)
PRIMARY-C13: U_primary_input_filter (6 pins), U_primary_LTC (IC1400_1.12)
PRIMARY-C14: U_primary_input_filter (6 pins), U_primary_LTC (IC1400_1.10)
PRIMARY-C15: U_primary_input_filter (6 pins), U_primary_LTC (IC1400_1.8)
PRIMARY-C16: U_primary_input_filter (6 pins), U_primary_LTC (IC1400_1.6)
PRIMARY-C17: U_primary_input_filter (6 pins), U_primary_LTC (IC1400_1.4)
PRIMARY-C18: U_primary_input_filter (C1324_1.1 C1330_1.1 R1313_1.2 Z1312_1.1), U_primary_LTC (IC1400_1.2)
PRIMARY-IN+: U_primary_LTC (TP1405_1.1 TR1400_1.4), daisy_chain_connectors (X500.2 X500.4)
PRIMARY-IN-: U_primary_LTC (TP1404_1.1 TR1400_1.6), daisy_chain_connectors (X500.1 X500.3)
PRIMARY-LTC-DRIVE: U_primary_LTC (IC1400_1.49), U_primary_dcdc_converter (R605_1.1 R610_1.2)
PRIMARY-MUX-DATA_TEMP: U_primary_LTC (R1409_1.1), U_primary_analog_in (C106_1.2 R108_1.2)
PRIMARY-MUX-DATA_USER: U_primary_LTC (R1411_1.1), U_primary_analog_in (C107_1.2 R109_1.2)
PRIMARY-OUT+: U_primary_LTC (TP1406_1.1 TR1400_1.1), daisy_chain_connectors (X501.2 X501.4)
PRIMARY-OUT-: U_primary_LTC (TP1407_1.1 TR1400_1.3), daisy_chain_connectors (X501.1 X501.3)
PRIMARY-S1: passive_balancing (R1517.2), U_primary_LTC (IC1400_1.37)
PRIMARY-S2: passive_balancing (R1516.2), U_primary_LTC (IC1400_1.35)
PRIMARY-S3: passive_balancing (R1515.2), U_primary_LTC (IC1400_1.33)
PRIMARY-S4: passive_balancing (R1514.2), U_primary_LTC (IC1400_1.31)
PRIMARY-S5: passive_balancing (R1513.2), U_primary_LTC (IC1400_1.29)
PRIMARY-S6: passive_balancing (R1512.2), U_primary_LTC (IC1400_1.27)
PRIMARY-S7: passive_balancing (R1535.2), U_primary_LTC (IC1400_1.25)
PRIMARY-S8: passive_balancing (R1534.2), U_primary_LTC (IC1400_1.23)
PRIMARY-S9: passive_balancing (R1533.2), U_primary_LTC (IC1400_1.21)
PRIMARY-S10: passive_balancing (R1532.2), U_primary_LTC (IC1400_1.19)
PRIMARY-S11: passive_balancing (R1531.2), U_primary_LTC (IC1400_1.17)
PRIMARY-S12: passive_balancing (R1530.2), U_primary_LTC (IC1400_1.15)
PRIMARY-S13: passive_balancing (R1553.2), U_primary_LTC (IC1400_1.13)
PRIMARY-S14: passive_balancing (R1552.2), U_primary_LTC (IC1400_1.11)
PRIMARY-S15: passive_balancing (R1551.2), U_primary_LTC (IC1400_1.9)
PRIMARY-S16: passive_balancing (R1550.2), U_primary_LTC (IC1400_1.7)
PRIMARY-S17: passive_balancing (R1549.2), U_primary_LTC (IC1400_1.5)
PRIMARY-S18: passive_balancing (R1548.2), U_primary_LTC (IC1400_1.3)
PRIMARY-SCL: U_primary_LTC (R1417_1.1 R1420_1.1 TP1409_1.1), U_primary_digital_io (U700_1.14), U_primary_eeprom_temp_sens (IC800_1.4 IC801_1.6), U_primary_analog_in (IC100_1.1 IC101_1.1 IC104_1.1)
PRIMARY-SDA: U_primary_LTC (R1415_1.1 R1419_1.1 TP1408_1.1), U_primary_digital_io (U700_1.15), U_primary_eeprom_temp_sens (IC800_1.5 IC801_1.5), U_primary_analog_in (IC100_1.3 IC101_1.3 IC104_1.3)
PRIMARY-T-SENSOR_0: bat_connectors (X201.16), U_primary_analog_in (R107_1.1 R112_1.2)
PRIMARY-T-SENSOR_1: bat_connectors (X201.14), U_primary_analog_in (R106_1.1 R113_1.2)
PRIMARY-T-SENSOR_2: bat_connectors (X201.12), U_primary_analog_in (R105_1.1 R114_1.2)
PRIMARY-T-SENSOR_3: bat_connectors (X201.10), U_primary_analog_in (R104_1.1 R115_1.2)
PRIMARY-T-SENSOR_4: bat_connectors (X201.8), U_primary_analog_in (R103_1.1 R116_1.2)
PRIMARY-T-SENSOR_5: bat_connectors (X201.6), U_primary_analog_in (R102_1.1 R117_1.2)
PRIMARY-T-SENSOR_6: bat_connectors (X201.4), U_primary_analog_in (R101_1.1 R118_1.2)
PRIMARY-T-SENSOR_7: bat_connectors (X201.2), U_primary_analog_in (R100_1.1 R119_1.2)
SECONDARY-ANALOG-IN_0: connectors (X401.1), U_secondary_analog_in (IC104_2.4)
SECONDARY-ANALOG-IN_1: connectors (X401.2), U_secondary_analog_in (IC104_2.5)
SECONDARY-ANALOG-IN_2: connectors (X401.3), U_secondary_analog_in (IC104_2.6)
SECONDARY-ANALOG-IN_3: connectors (X401.4), U_secondary_analog_in (IC104_2.7)
SECONDARY-ANALOG-IN_4: connectors (X401.5), U_secondary_analog_in (IC104_2.12)
SECONDARY-ANALOG-IN_5: connectors (X401.6), U_secondary_analog_in (IC104_2.11)
SECONDARY-ANALOG-IN_6: connectors (X401.7), U_secondary_analog_in (IC104_2.10)
SECONDARY-ANALOG-IN_7: connectors (X401.8), U_secondary_analog_in (IC104_2.9)
SECONDARY-ANALOG-IN_8: connectors (X401.9), U_secondary_analog_in (IC101_2.4)
SECONDARY-ANALOG-IN_9: connectors (X401.10), U_secondary_analog_in (IC101_2.5)
SECONDARY-ANALOG-IN_10: connectors (X401.11), U_secondary_analog_in (IC101_2.6)
SECONDARY-ANALOG-IN_11: connectors (X401.12), U_secondary_analog_in (IC101_2.7)
SECONDARY-ANALOG-IN_12: connectors (X401.13), U_secondary_analog_in (IC101_2.12)
SECONDARY-ANALOG-IN_13: connectors (X401.14), U_secondary_analog_in (IC101_2.11)
SECONDARY-ANALOG-IN_14: connectors (X401.15), U_secondary_analog_in (IC101_2.10)
SECONDARY-ANALOG-IN_15: connectors (X401.16), U_secondary_analog_in (IC101_2.9)
SECONDARY-C0: U_secondary_input_filter (C1311_2.2 R1306_2.2 Z1305_2.2), U_secondary_LTC (IC1400_2.38)
SECONDARY-C1: U_secondary_input_filter (6 pins), U_secondary_LTC (IC1400_2.36)
SECONDARY-C2: U_secondary_input_filter (6 pins), U_secondary_LTC (IC1400_2.34)
SECONDARY-C3: U_secondary_input_filter (6 pins), U_secondary_LTC (IC1400_2.32)
SECONDARY-C4: U_secondary_input_filter (6 pins), U_secondary_LTC (IC1400_2.30)
SECONDARY-C5: U_secondary_input_filter (6 pins), U_secondary_LTC (IC1400_2.28)
SECONDARY-C6: U_secondary_input_filter (6 pins), U_secondary_LTC (IC1400_2.26)
SECONDARY-C7: U_secondary_input_filter (6 pins), U_secondary_LTC (IC1400_2.24)
SECONDARY-C8: U_secondary_input_filter (6 pins), U_secondary_LTC (IC1400_2.22)
SECONDARY-C9: U_secondary_input_filter (6 pins), U_secondary_LTC (IC1400_2.20)
SECONDARY-C10: U_secondary_input_filter (6 pins), U_secondary_LTC (IC1400_2.18)
SECONDARY-C11: U_secondary_input_filter (6 pins), U_secondary_LTC (IC1400_2.16)
SECONDARY-C12: U_secondary_input_filter (6 pins), U_secondary_LTC (IC1400_2.14)
SECONDARY-C13: U_secondary_input_filter (6 pins), U_secondary_LTC (IC1400_2.12)
SECONDARY-C14: U_secondary_input_filter (6 pins), U_secondary_LTC (IC1400_2.10)
SECONDARY-C15: U_secondary_input_filter (6 pins), U_secondary_LTC (IC1400_2.8)
SECONDARY-C16: U_secondary_input_filter (6 pins), U_secondary_LTC (IC1400_2.6)
SECONDARY-C17: U_secondary_input_filter (6 pins), U_secondary_LTC (IC1400_2.4)
SECONDARY-C18: U_secondary_input_filter (C1324_2.1 C1330_2.1 R1313_2.2 Z1312_2.1), U_secondary_LTC (IC1400_2.2)
SECONDARY-LTC-DRIVE: U_secondary_dcdc_converter (R605_2.1 R610_2.2), U_secondary_LTC (IC1400_2.49)
SECONDARY-MUX-DATA_TEMP: U_secondary_analog_in (C106_2.2 R108_2.2), U_secondary_LTC (R1409_2.1)
SECONDARY-MUX-DATA_USER: U_secondary_analog_in (C107_2.2 R109_2.2), U_secondary_LTC (R1411_2.1)
SECONDARY-SCL: U_secondary_digital_io (U700_2.14), U_secondary_eeprom_temp_sens (IC800_2.4 IC801_2.6), U_secondary_analog_in (IC100_2.1 IC101_2.1 IC104_2.1), U_secondary_LTC (R1417_2.1 R1420_2.1 TP1409_2.1)
SECONDARY-SDA: U_secondary_digital_io (U700_2.15), U_secondary_eeprom_temp_sens (IC800_2.5 IC801_2.5), U_secondary_analog_in (IC100_2.3 IC101_2.3 IC104_2.3), U_secondary_LTC (R1415_2.1 R1419_2.1 TP1408_2.1)
SECONDARY-T-SENSOR_0: U_secondary_analog_in (R107_2.1 R112_2.2), bat_connectors (X202.16)
SECONDARY-T-SENSOR_1: U_secondary_analog_in (R106_2.1 R113_2.2), bat_connectors (X202.14)
SECONDARY-T-SENSOR_2: U_secondary_analog_in (R105_2.1 R114_2.2), bat_connectors (X202.12)
SECONDARY-T-SENSOR_3: U_secondary_analog_in (R104_2.1 R115_2.2), bat_connectors (X202.10)
SECONDARY-T-SENSOR_4: U_secondary_analog_in (R103_2.1 R116_2.2), bat_connectors (X202.8)
SECONDARY-T-SENSOR_5: U_secondary_analog_in (R102_2.1 R117_2.2), bat_connectors (X202.6)
SECONDARY-T-SENSOR_6: U_secondary_analog_in (R101_2.1 R118_2.2), bat_connectors (X202.4)
SECONDARY-T-SENSOR_7: U_secondary_analog_in (R100_2.1 R119_2.2), bat_connectors (X202.2)

## Assembly variants
default: not fitted C100_2 C101_2 C102_2 C103_2 C104_2 C105_2 C106_2 C107_2 C108_2 C109_2 C110_2 C111_2 C112_2 C113_2 C114_2 C115_2 C600_2 C601_2 C602_2 C603_2 C604_2 C605_2 C606_2 C607_2 C608_2 C700_2 C701_2 C800_2 C801_2 C1300_2 C1301_2 C1302_2 C1303_2 C1304_2 C1305_2 C1306_1 C1306_2 C1307_1 C1307_2 C1308_1 C1308_2 C1309_1 C1309_2 C1310_1 C1310_2 C1311_1 C1311_2 C1312_2 C1313_2 C1314_2 C1315_2 C1316_2 C1317_2 C1318_1 C1318_2 C1319_1 C1319_2 C1320_1 C1320_2 C1321_1 C1321_2 C1322_1 C1322_2 C1323_1 C1323_2 C1324_2 C1325_2 C1326_2 C1327_2 C1328_2 C1329_2 C1330_1 C1330_2 C1331_1 C1331_2 C1332_1 C1332_2 C1333_1 C1333_2 C1334_1 C1334_2 C1335_1 C1335_2 C1400_2 C1401_2 C1402_2 C1403_2 C1404_2 C1405_2 D1400_2 D1401_2 IC100_2 IC101_2 IC104_2 IC800_2 IC801_2 L600_2 LD1400_2 Q600_2 R100_2 R101_2 R102_2 R103_2 R104_2 R105_2 R106_2 R107_2 R108_2 R109_2 R110_1 R110_2 R111_1 R111_2 R112_2 R113_2 R114_2 R115_2 R116_2 R117_2 R118_2 R119_2 R600_2 R601_2 R602_2 R603_2 R604_2 R605_2 R606_2 R607_2 R608_2 R609_1 R609_2 R610_2 R700_2 R701_2 R702_2 R703_2 R704_2 R705_2 R706_2 R707_2 R708_2 R800_2 R801_1 R801_2 R902 R1300_2 R1301_2 R1302_2 R1303_2 R1304_2 R1305_2 R1306_2 R1307_2 R1308_2 R1309_2 R1310_2 R1311_2 R1312_2 R1313_2 R1314_2 R1315_2 R1316_2 R1317_2 R1318_2 R1400_2 R1401_2 R1402_2 R1403_2 R1404_2 R1405_2 R1406_1 R1406_2 R1407_2 R1408_1 R1408_2 R1409_2 R1410_1 R1410_2 R1411_2 R1412_1 R1412_2 R1413_2 R1414_1 R1414_2 R1415_2 R1416_1 R1416_2 R1417_2 R1418_2 R1419_2 R1420_2 R1421_2 R1422_2 R1423_2 R1424_2 R1425_1 R1425_2 R1426_1 R1426_2 R1427_1 R1427_2 SJ300 SJ301 TR1400_2 U100_2 U101_2 U600_2 U700_2 Z1300_2 Z1301_2 Z1302_2 Z1303_2 Z1304_2 Z1305_2 Z1306_2 Z1307_2 Z1308_2 Z1309_2 Z1310_2 Z1311_2 Z1312_2 Z1313_2 Z1314_2 Z1315_2 Z1316_2 Z1317_2
automotive: not fitted C100_2 C101_2 C102_2 C103_2 C104_2 C105_2 C106_2 C107_2 C108_2 C109_2 C110_2 C111_2 C112_2 C113_2 C114_2 C115_2 C600_2 C601_2 C602_2 C603_2 C604_2 C605_2 C606_2 C607_2 C608_2 C700_2 C701_2 C800_2 C801_2 C1300_2 C1301_2 C1302_2 C1303_2 C1304_2 C1305_2 C1306_1 C1306_2 C1307_1 C1307_2 C1308_1 C1308_2 C1309_1 C1309_2 C1310_1 C1310_2 C1311_1 C1311_2 C1312_2 C1313_2 C1314_2 C1315_2 C1316_2 C1317_2 C1318_1 C1318_2 C1319_1 C1319_2 C1320_1 C1320_2 C1321_1 C1321_2 C1322_1 C1322_2 C1323_1 C1323_2 C1324_2 C1325_2 C1326_2 C1327_2 C1328_2 C1329_2 C1330_1 C1330_2 C1331_1 C1331_2 C1332_1 C1332_2 C1333_1 C1333_2 C1334_1 C1334_2 C1335_1 C1335_2 C1400_2 C1401_2 C1402_2 C1403_2 C1404_2 C1405_2 D1400_2 D1401_2 IC100_2 IC101_2 IC104_2 IC800_2 IC801_2 L600_2 LD1400_2 Q600_2 R100_2 R101_2 R102_2 R103_2 R104_2 R105_2 R106_2 R107_2 R108_2 R109_2 R110_1 R110_2 R111_1 R111_2 R112_2 R113_2 R114_2 R115_2 R116_2 R117_2 R118_2 R119_2 R600_2 R601_2 R602_2 R603_2 R604_2 R605_2 R606_2 R607_2 R608_2 R609_1 R609_2 R610_2 R700_2 R701_2 R702_2 R703_2 R704_2 R705_2 R706_2 R707_2 R708_2 R800_2 R801_1 R801_2 R902 R1300_2 R1301_2 R1302_2 R1303_2 R1304_2 R1305_2 R1306_2 R1307_2 R1308_2 R1309_2 R1310_2 R1311_2 R1312_2 R1313_2 R1314_2 R1315_2 R1316_2 R1317_2 R1318_2 R1400_2 R1401_2 R1402_2 R1403_2 R1404_2 R1405_2 R1406_1 R1406_2 R1407_2 R1408_1 R1408_2 R1409_2 R1410_1 R1410_2 R1411_2 R1412_1 R1412_2 R1413_2 R1414_1 R1414_2 R1415_2 R1416_1 R1416_2 R1417_2 R1418_2 R1419_2 R1420_2 R1421_2 R1422_2 R1423_2 R1424_2 R1425_1 R1425_2 R1426_1 R1426_2 R1427_1 R1427_2 SJ300 SJ301 TR1400_2 U100_2 U101_2 U600_2 U700_2 Z1300_2 Z1301_2 Z1302_2 Z1303_2 Z1304_2 Z1305_2 Z1306_2 Z1307_2 Z1308_2 Z1309_2 Z1310_2 Z1311_2 Z1312_2 Z1313_2 Z1314_2 Z1315_2 Z1316_2 Z1317_2; alternate parts U1100 -> TLX9291A, U1101 -> TLX9291A, U1117 -> TLX9291A, U1116 -> TLX9291A, U1115 -> TLX9291A, U1114 -> TLX9291A, U1113 -> TLX9291A, U1112 -> TLX9291A, U1111 -> TLX9291A, U1110 -> TLX9291A, U1109 -> TLX9291A, U1108 -> TLX9291A, U1107 -> TLX9291A, U1106 -> TLX9291A, U1105 -> TLX9291A, U1104 -> TLX9291A, U1103 -> TLX9291A, U1102 -> TLX9291A
automotive_single-AFE: not fitted C100_2 C101_2 C102_2 C103_2 C104_2 C105_2 C106_2 C107_2 C108_2 C109_2 C110_2 C111_2 C112_2 C113_2 C114_2 C115_2 C600_2 C601_2 C602_2 C603_2 C604_2 C605_2 C606_2 C607_2 C608_2 C700_2 C701_2 C800_2 C801_2 C1300_2 C1301_2 C1302_2 C1303_2 C1304_2 C1305_2 C1306_1 C1306_2 C1307_1 C1307_2 C1308_1 C1308_2 C1309_1 C1309_2 C1310_1 C1310_2 C1311_1 C1311_2 C1312_2 C1313_2 C1314_2 C1315_2 C1316_2 C1317_2 C1318_1 C1318_2 C1319_1 C1319_2 C1320_1 C1320_2 C1321_1 C1321_2 C1322_1 C1322_2 C1323_1 C1323_2 C1324_2 C1325_2 C1326_2 C1327_2 C1328_2 C1329_2 C1330_1 C1330_2 C1331_1 C1331_2 C1332_1 C1332_2 C1333_1 C1333_2 C1334_1 C1334_2 C1335_1 C1335_2 C1400_2 C1401_2 C1402_2 C1403_2 C1404_2 C1405_2 D1400_2 D1401_2 IC100_2 IC101_2 IC104_2 IC800_2 IC801_2 IC1400_2 L600_2 LD1400_2 Q600_2 R100_2 R101_2 R102_2 R103_2 R104_2 R105_2 R106_2 R107_2 R108_2 R109_2 R110_1 R110_2 R111_1 R111_2 R112_2 R113_2 R114_2 R115_2 R116_2 R117_2 R118_2 R119_2 R600_2 R601_2 R602_2 R603_2 R604_2 R605_2 R606_2 R607_2 R608_2 R609_1 R609_2 R610_2 R700_2 R701_2 R702_2 R703_2 R704_2 R705_2 R706_2 R707_2 R708_2 R800_2 R801_1 R801_2 R902 R1300_2 R1301_2 R1302_2 R1303_2 R1304_2 R1305_2 R1306_2 R1307_2 R1308_2 R1309_2 R1310_2 R1311_2 R1312_2 R1313_2 R1314_2 R1315_2 R1316_2 R1317_2 R1318_2 R1400_2 R1401_2 R1402_2 R1403_2 R1404_2 R1405_2 R1406_1 R1406_2 R1407_2 R1408_1 R1408_2 R1409_2 R1410_1 R1410_2 R1411_2 R1412_1 R1412_2 R1413_2 R1414_1 R1414_2 R1415_2 R1416_1 R1416_2 R1417_2 R1418_2 R1419_2 R1420_2 R1421_2 R1422_2 R1423_2 R1424_2 R1425_1 R1425_2 R1426_1 R1426_2 R1427_1 R1427_2 SJ300 SJ301 TR1400_2 U100_2 U101_2 U600_2 U700_2 Z1300_2 Z1301_2 Z1302_2 Z1303_2 Z1304_2 Z1305_2 Z1306_2 Z1307_2 Z1308_2 Z1309_2 Z1310_2 Z1311_2 Z1312_2 Z1313_2 Z1314_2 Z1315_2 Z1316_2 Z1317_2; alternate parts U1100 -> TLX9291A, U1101 -> TLX9291A, U1117 -> TLX9291A, U1116 -> TLX9291A, U1115 -> TLX9291A, U1114 -> TLX9291A, U1113 -> TLX9291A, U1112 -> TLX9291A, U1111 -> TLX9291A, U1110 -> TLX9291A, U1109 -> TLX9291A, U1108 -> TLX9291A, U1107 -> TLX9291A, U1106 -> TLX9291A, U1105 -> TLX9291A, U1104 -> TLX9291A, U1103 -> TLX9291A, U1102 -> TLX9291A